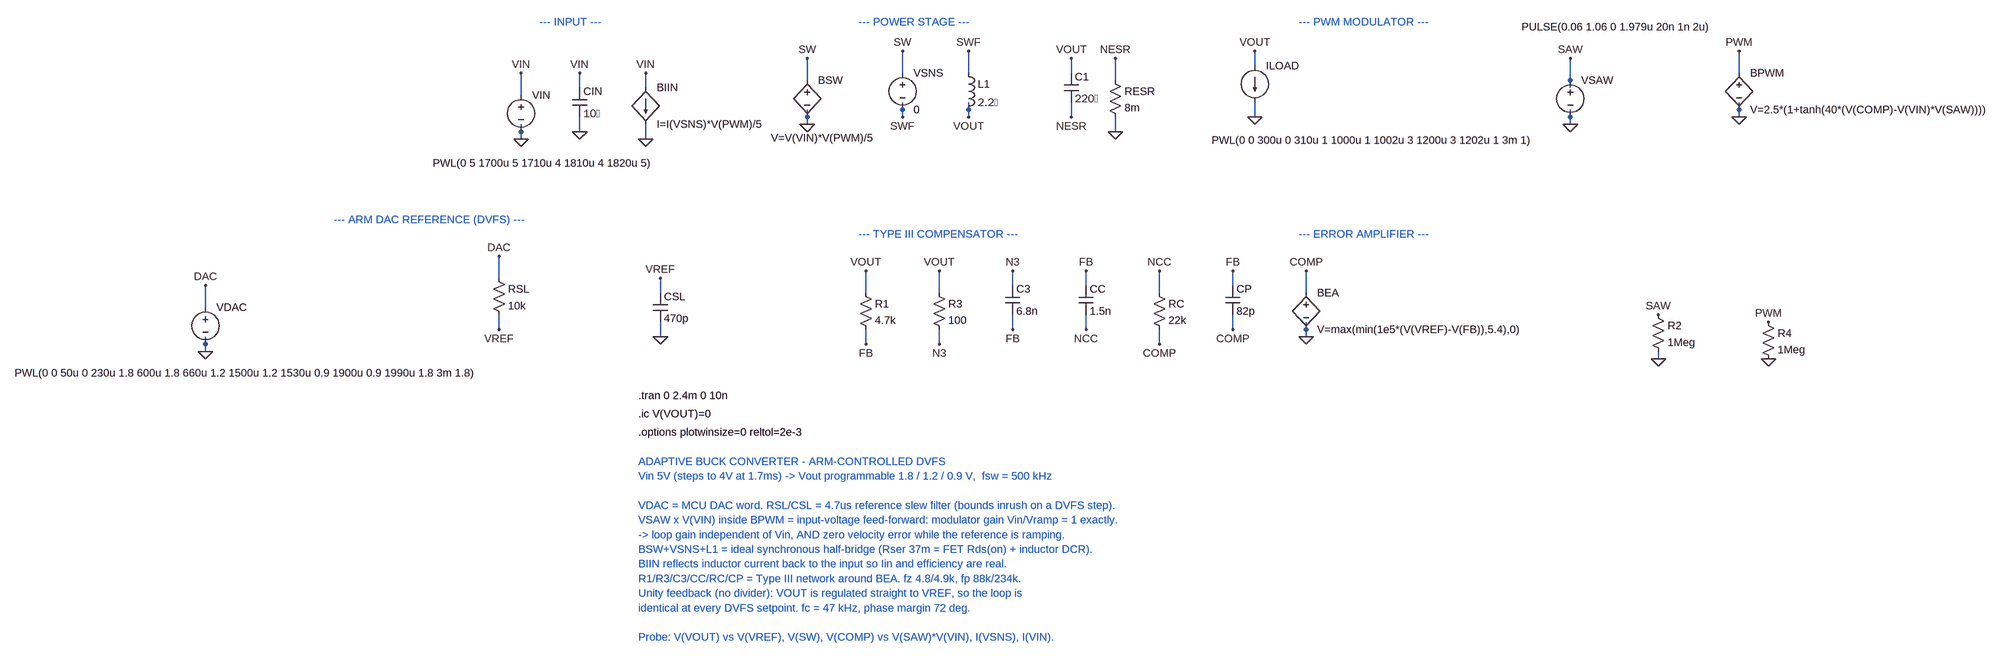
[diagram p0: schematic adaptive_buck_dvfs.asc]
adaptive_buck_dvfs.asc, the LTspice schematic file:
Version 4.1
SHEET 1 3096 1560
WIRE 1440 160 1440 128
WIRE 672 176 672 128
WIRE 816 176 816 128
WIRE 1040 176 1040 144
WIRE 2496 176 2496 128
WIRE 464 192 464 144
WIRE 1136 192 1136 144
WIRE 2128 192 2128 144
WIRE -32 208 -32 176
WIRE 112 208 112 176
WIRE 2128 208 2128 192
WIRE -160 224 -160 176
WIRE 672 256 672 240
WIRE 816 256 816 240
WIRE 2496 256 2496 240
WIRE 464 272 464 256
WIRE 672 272 672 256
WIRE 816 272 816 256
WIRE 1040 272 1040 240
WIRE 1440 272 1440 240
WIRE 2128 272 2128 256
WIRE 2496 272 2496 256
WIRE 464 288 464 272
WIRE 2128 288 2128 272
WIRE -160 304 -160 288
WIRE -32 304 -32 272
WIRE 1136 304 1136 272
WIRE -160 320 -160 304
WIRE 112 320 112 288
WIRE -208 624 -208 576
WIRE 912 640 912 608
WIRE 1072 640 1072 608
WIRE 1392 640 1392 608
WIRE 144 656 144 624
WIRE 592 656 592 608
WIRE 752 656 752 608
WIRE 1232 656 1232 608
WIRE 1552 656 1552 608
WIRE -848 688 -848 640
WIRE -208 736 -208 704
WIRE 912 736 912 704
WIRE 1072 736 1072 704
WIRE 1392 736 1392 704
WIRE 1552 736 1552 720
WIRE 144 752 144 720
WIRE 1552 752 1552 736
WIRE -848 768 -848 752
WIRE 592 768 592 736
WIRE 752 768 752 736
WIRE 1232 768 1232 736
WIRE -848 784 -848 768
WIRE 2320 800 2320 784
FLAG -160 176 VIN
FLAG -160 320 0
FLAG -32 176 VIN
FLAG -32 304 0
FLAG 112 176 VIN
FLAG 112 320 0
FLAG 464 144 SW
FLAG 464 288 0
FLAG 672 128 SW
FLAG 672 272 SWF
FLAG 816 128 SWF
FLAG 816 272 VOUT
FLAG 1040 144 VOUT
FLAG 1040 272 NESR
FLAG 1136 144 NESR
FLAG 1136 304 0
FLAG 1440 128 VOUT
FLAG 1440 272 0
FLAG 2128 144 SAW
FLAG 2128 288 0
FLAG 2496 128 PWM
FLAG 2496 272 0
FLAG -848 640 DAC
FLAG -848 784 0
FLAG -208 576 DAC
FLAG -208 736 VREF
FLAG 144 624 VREF
FLAG 144 752 0
FLAG 592 608 VOUT
FLAG 592 768 FB
FLAG 752 608 VOUT
FLAG 752 768 N3
FLAG 912 608 N3
FLAG 912 736 FB
FLAG 1072 608 FB
FLAG 1072 736 NCC
FLAG 1232 608 NCC
FLAG 1232 768 COMP
FLAG 1392 608 FB
FLAG 1392 736 COMP
FLAG 1552 608 COMP
FLAG 1552 752 0
FLAG 2560 800 0
FLAG 2320 800 0
FLAG 2320 704 SAW
FLAG 2560 720 PWM
SYMBOL voltage -160 208 R0
WINDOW 3 -192 165 Left 2
SYMATTR InstName VIN
SYMATTR Value PWL(0 5 1700u 5 1710u 4 1810u 4 1820u 5)
SYMBOL cap -48 208 R0
SYMATTR InstName CIN
SYMATTR Value 10�
SYMBOL bi 112 208 R0
SYMATTR InstName BIIN
SYMATTR Value I=I(VSNS)*V(PWM)/5
SYMBOL bv 464 176 R0
WINDOW 3 -79 142 Left 2
SYMATTR InstName BSW
SYMATTR Value V=V(VIN)*V(PWM)/5
SYMBOL voltage 672 160 R0
SYMATTR InstName VSNS
SYMATTR Value 0
SYMBOL ind 800 160 R0
SYMATTR InstName L1
SYMATTR Value 2.2�
SYMATTR SpiceLine Rser=37m
SYMBOL cap 1024 176 R0
SYMATTR InstName C1
SYMATTR Value 220�
SYMBOL res 1120 176 R0
SYMATTR InstName RESR
SYMATTR Value 8m
SYMBOL current 1440 160 R0
WINDOW 3 -94 163 Left 2
SYMATTR InstName ILOAD
SYMATTR Value PWL(0 0 300u 0 310u 1 1000u 1 1002u 3 1200u 3 1202u 1 3m 1)
SYMBOL voltage 2128 176 R0
WINDOW 3 -106 -101 Left 2
SYMATTR InstName VSAW
SYMATTR Value PULSE(0.06 1.06 0 1.979u 20n 1n 2u)
SYMBOL bv 2496 160 R0
SYMATTR InstName BPWM
SYMATTR Value V=2.5*(1+tanh(40*(V(COMP)-V(VIN)*V(SAW))))
SYMBOL voltage -848 672 R0
WINDOW 3 -416 159 Left 2
SYMATTR InstName VDAC
SYMATTR Value PWL(0 0 50u 0 230u 1.8 600u 1.8 660u 1.2 1500u 1.2 1530u 0.9 1900u 0.9 1990u 1.8 3m 1.8)
SYMBOL res -224 608 R0
SYMATTR InstName RSL
SYMATTR Value 10k
SYMBOL cap 128 656 R0
SYMATTR InstName CSL
SYMATTR Value 470p
SYMBOL res 576 640 R0
SYMATTR InstName R1
SYMATTR Value 4.7k
SYMBOL res 736 640 R0
SYMATTR InstName R3
SYMATTR Value 100
SYMBOL cap 896 640 R0
SYMATTR InstName C3
SYMATTR Value 6.8n
SYMBOL cap 1056 640 R0
SYMATTR InstName CC
SYMATTR Value 1.5n
SYMBOL res 1216 640 R0
SYMATTR InstName RC
SYMATTR Value 22k
SYMBOL cap 1376 640 R0
SYMATTR InstName CP
SYMATTR Value 82p
SYMBOL bv 1552 640 R0
SYMATTR InstName BEA
SYMATTR Value V=max(min(1e5*(V(VREF)-V(FB)),5.4),0)
SYMBOL res 2304 688 R0
SYMATTR InstName R2
SYMATTR Value 1Meg
SYMATTR SpiceLine tol=1 pwr=0.1
SYMBOL res 2544 704 R0
SYMATTR InstName R4
SYMATTR Value 1Meg
SYMATTR SpiceLine tol=1 pwr=0.1
TEXT -120 64 Left 2 ;--- INPUT ---
TEXT 576 64 Left 2 ;--- POWER STAGE ---
TEXT 1536 64 Left 2 ;--- PWM MODULATOR ---
TEXT -568 496 Left 2 ;--- ARM DAC REFERENCE (DVFS) ---
TEXT 576 528 Left 2 ;--- TYPE III COMPENSATOR ---
TEXT 1536 528 Left 2 ;--- ERROR AMPLIFIER ---
TEXT 96 880 Left 2 !.tran 0 2.4m 0 10n
TEXT 96 920 Left 2 !.ic V(VOUT)=0
TEXT 96 960 Left 2 !.options plotwinsize=0 reltol=2e-3
TEXT 96 1024 Left 2 ;ADAPTIVE BUCK CONVERTER - ARM-CONTROLLED DVFS
TEXT 96 1056 Left 2 ;Vin 5V (steps to 4V at 1.7ms) -> Vout programmable 1.8 / 1.2 / 0.9 V,  fsw = 500 kHz
TEXT 96 1120 Left 2 ;VDAC = MCU DAC word. RSL/CSL = 4.7us reference slew filter (bounds inrush on a DVFS step).
TEXT 96 1152 Left 2 ;VSAW x V(VIN) inside BPWM = input-voltage feed-forward: modulator gain Vin/Vramp = 1 exactly.
TEXT 96 1184 Left 2 ;-> loop gain independent of Vin, AND zero velocity error while the reference is ramping.
TEXT 96 1216 Left 2 ;BSW+VSNS+L1 = ideal synchronous half-bridge (Rser 37m = FET Rds(on) + inductor DCR).
TEXT 96 1248 Left 2 ;BIIN reflects inductor current back to the input so Iin and efficiency are real.
TEXT 96 1280 Left 2 ;R1/R3/C3/CC/RC/CP = Type III network around BEA. fz 4.8/4.9k, fp 88k/234k.
TEXT 96 1312 Left 2 ;Unity feedback (no divider): VOUT is regulated straight to VREF, so the loop is
TEXT 96 1344 Left 2 ;identical at every DVFS setpoint. fc = 47 kHz, phase margin 72 deg.
TEXT 96 1408 Left 2 ;Probe: V(VOUT) vs V(VREF), V(SW), V(COMP) vs V(SAW)*V(VIN), I(VSNS), I(VIN).

The netlist it stands for:
* adaptive_buck_dvfs.asc
VIN VIN 0 PWL(0 5 1700u 5 1710u 4 1810u 4 1820u 5)
CIN VIN 0 10�
BIIN VIN 0 I=I(VSNS)*V(PWM)/5
BSW SW 0 V=V(VIN)*V(PWM)/5
VSNS SW SWF 0
L1 SWF VOUT 2.2� Rser=37m
C1 VOUT NESR 220�
RESR NESR 0 8m
ILOAD VOUT 0 PWL(0 0 300u 0 310u 1 1000u 1 1002u 3 1200u 3 1202u 1 3m 1)
VSAW SAW 0 PULSE(0.06 1.06 0 1.979u 20n 1n 2u)
BPWM PWM 0 V=2.5*(1+tanh(40*(V(COMP)-V(VIN)*V(SAW))))
VDAC DAC 0 PWL(0 0 50u 0 230u 1.8 600u 1.8 660u 1.2 1500u 1.2 1530u 0.9 1900u 0.9 1990u 1.8 3m 1.8)
RSL DAC VREF 10k
CSL VREF 0 470p
R1 VOUT FB 4.7k
R3 VOUT N3 100
C3 N3 FB 6.8n
CC FB NCC 1.5n
RC NCC COMP 22k
CP FB COMP 82p
BEA COMP 0 V=max(min(1e5*(V(VREF)-V(FB)),5.4),0)
R2 SAW 0 1Meg tol=1 pwr=0.1
R4 PWM 0 1Meg tol=1 pwr=0.1
* --- INPUT ---
* --- POWER STAGE ---
* --- PWM MODULATOR ---
* --- ARM DAC REFERENCE (DVFS) ---
* --- TYPE III COMPENSATOR ---
* --- ERROR AMPLIFIER ---
.tran 0 2.4m 0 10n
.ic V(VOUT)=0
.options plotwinsize=0 reltol=2e-3
* ADAPTIVE BUCK CONVERTER - ARM-CONTROLLED DVFS
* Vin 5V (steps to 4V at 1.7ms) -> Vout programmable 1.8 / 1.2 / 0.9 V,  fsw = 500 kHz
* VDAC = MCU DAC word. RSL/CSL = 4.7us reference slew filter (bounds inrush on a DVFS step).
* VSAW x V(VIN) inside BPWM = input-voltage feed-forward: modulator gain Vin/Vramp = 1 exactly.
* -> loop gain independent of Vin, AND zero velocity error while the reference is ramping.
* BSW+VSNS+L1 = ideal synchronous half-bridge (Rser 37m = FET Rds(on) + inductor DCR).
* BIIN reflects inductor current back to the input so Iin and efficiency are real.
* R1/R3/C3/CC/RC/CP = Type III network around BEA. fz 4.8/4.9k, fp 88k/234k.
* Unity feedback (no divider): VOUT is regulated straight to VREF, so the loop is
* identical at every DVFS setpoint. fc = 47 kHz, phase margin 72 deg.
* Probe: V(VOUT) vs V(VREF), V(SW), V(COMP) vs V(SAW)*V(VIN), I(VSNS), I(VIN).
.backanno
.end